# EAGLE design PSOC_10pin_to_ZIF (EAGLE 6.3)
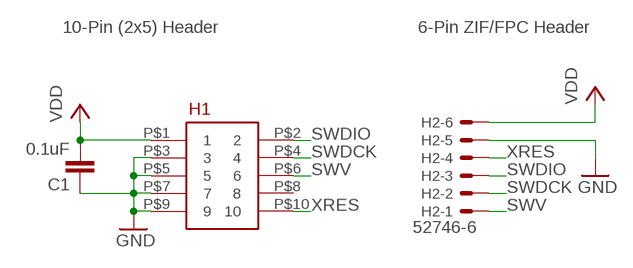
[diagram p0: schematic, sheet 1]

## Parts
C1  0.1uF  CC0603-N  [CAPC1608X90N]
H1  2X5_SMD_HEADER_1.27MM  [2X5_SMD_HEADER_1.27MM]
H2  52746-6  [52746-6]

## Nets
GND: C1.1 H1.P$3 H1.P$5 H1.P$7 H1.P$9 H2.5
SWDCK: H1.P$4 H2.2
SWDIO: H1.P$2 H2.3
SWV: H1.P$6 H2.1
VDD: C1.2 H1.P$1 H2.6
XRES: H1.P$10 H2.4
Unconnected: H1.P$8

## Notes on the sheet
- 10-Pin (2x5) Header | 6-Pin ZIF/FPC Header

## Library data of the parts
C1 = Ramshur:C: Capacitor (english/metric) cermaic capacitor nominal landpattern (N).
H1 = Ramshur:2X5_SMD_HEADER_1.27MM: 2x5 SMD Header with 1.27mm (50mil) spacing. PSoC Programming header.
H2 = con-molex:52746-6: FPC Connector ZIF for SMT 0.5mm Source: http://www.farnell.com/datasheets/73044.pdf [DWG. NO. (Sheet 1 OF 2) SD-52746-**17]; OC_FARNELL: unknown; OC_NEWARK: unknown

## Board
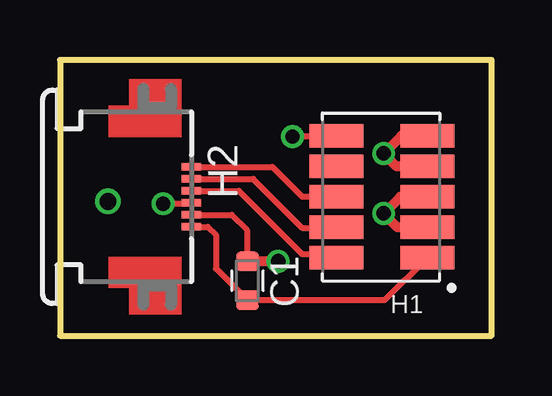
[diagram p1: board, top side]
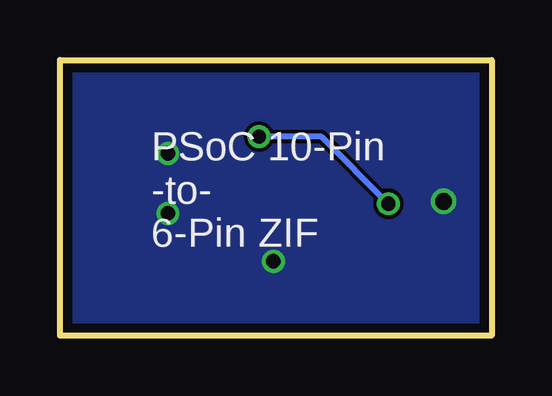
[diagram p2: board, bottom side, seen from below]

Size 18 x 11.5 mm. Coordinates in mm from the lower left corner, seen from the top.
Outline: 0,0 18,0 18,11.5 0,11.5 0,0
Copper layers (1*16): Top 0.0356mm / dielectric 1.5011mm / Bottom 0.0356mm
Design rules "LaenPCBOrder *": minimum track width 6mil, minimum drill 13mil, track to track 6mil, track to pad 6mil, pad to pad 6mil, via to via 6mil, smd to smd 6mil, copper to edge 15mil, drill to drill 6mil, minimum pad ring 7mil, minimum via ring 7mil, stop-mask expansion 4mil, vias tented up to drill 0.6mm, thermal gap 10mil

### Footprints (pad centres in the part's own frame; a part is rotated, then mirrored left to right if it is on the bottom)
CAPC1608X90N = smd 0.81 x 0.93: 1 -0.81,0; 2 0.81,0
2X5_SMD_HEADER_1.27MM = smd 1 x 2.3: P$1 -2.54,-1.88; P$2 -2.54,1.91; P$3 -1.27,-1.88; P$4 -1.27,1.91; P$5 0,-1.88; P$6 0,1.91; P$7 1.27,-1.88; P$8 1.27,1.91; P$9 2.54,-1.88; P$10 2.54,1.91
52746-6 = smd 0.3 x 0.8: 1 -1.25,0.6; 2 -0.75,0.6; 3 -0.25,0.6; 4 0.25,0.6; 5 0.75,0.6; 6 1.25,0.6

### Placement (x,y rotation side)
C1  7.82,2.29 270 top
H1  13.44,5.79 90 top
H2  4.88,5.79 270 top

### Tracks (layer width: path | path; a pad name or v marks a point on that pad's centre or on a via)
GND  (via drill 0.6, 0.7)
  Top 0.254: H2.5 7.16,5.04 7.8,4.4 7.8,3.12 C1.1 8,3.1 | 15.25,8.4 H1.P$9
  Top 0.406: H1.P$5 14.19,5.79 v13.5,5.1 14.08,4.52 H1.P$3 | H1.P$7 14.04,7.06 v13.5,7.6 14.23,8.33 H1.P$9 | 8,3.1 9,3.1 v9.1,3.1
  other vias: 2,5.6
  pour Bottom: 0.3,11.4 0,0 18,0 18,11.5
SWDCK
  Top 0.254: H2.2 8.06,6.54 10.1,4.5 11.51,4.5 H1.P$4
SWDIO
  Top 0.254: H2.3 7.46,6.04 10.1,3.4 11.38,3.4 H1.P$2
SWV
  Top 0.254: H2.1 8.86,7.04 10.1,5.8 H1.P$6
VDD
  Top 0.254: H2.6 6.16,4.54 6.5,4.2 6.5,2.8 C1.2 13.55,1.48 H1.P$1
XRES  (via drill 0.6)
  Top 0.254: H2.4 5.44,5.5 v4.3,5.5 | v9.7,8.3 9.73,8.33 H1.P$10
  Bottom 0.254: v4.3,5.5 7.1,8.3 v9.7,8.3

### Text on the board
bPlace: PSoC 10-Pin / -to- / 6-Pin ZIF